# Altium schematic sheet rear_controller.SchDoc
size A; SheetNumber: 1; SheetTotal: 1
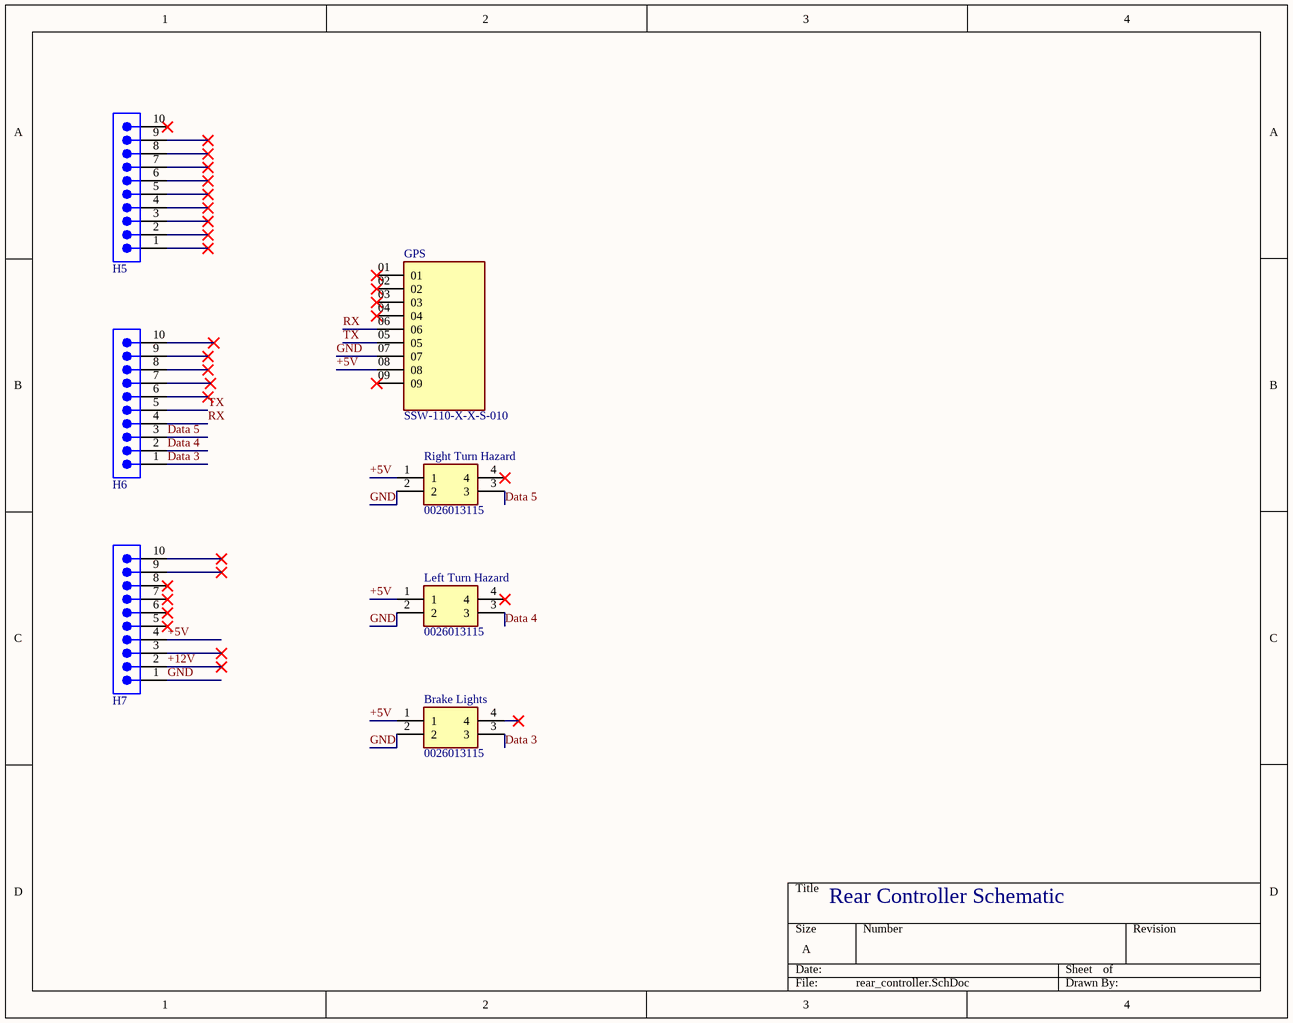
[diagram p0: rear_controller.SchDoc]

## Parts
Brake_Lights  0026013115  [MOLEX_0026013115]
GPS  SSW-110-X-X-S-010  [SAMTEC_SSW-110-X-X-S-010]
H5  61301011121  [61301011121]  (value not drawn)
H6  61301011121  [61301011121]  (value not drawn)
H7  61301011121  [61301011121]  (value not drawn)
Left_Turn_Hazard  0026013115  [MOLEX_0026013115]
Right_Turn_Hazard  0026013115  [MOLEX_0026013115]

## Nets
+5V: Brake_Lights.1 GPS.08 H7.4 Left_Turn_Hazard.1 Right_Turn_Hazard.1
+12V: H7.2
Data 3: Brake_Lights.3 H6.1
Data 4: H6.2 Left_Turn_Hazard.3
Data 5: H6.3 Right_Turn_Hazard.3
GND: Brake_Lights.2 GPS.07 H7.1 Left_Turn_Hazard.2 Right_Turn_Hazard.2
RX: GPS.06 H6.4
TX: GPS.05 H6.5

Not connected (* = marked no-connect by the designer): Brake_Lights 4*; GPS 01* 02* 03* 04* 09*; H5 1* 2* 3* 4* 5* 6* 7* 8* 9* 10*; H6 6* 7* 8* 9* 10*; H7 3* 5* 6* 7* 8* 9* 10*; Left_Turn_Hazard 4*; Right_Turn_Hazard 4*

## Notes on the sheet
- Rear Controller Schematic

## Library data of the parts
Brake_Lights Left_Turn_Hazard Right_Turn_Hazard = 0026013115: Connector Header Through Hole, Right Angle 4 position 0.165 (4.20mm); MF: Molex; Package: None; MP: 0026013115; DigiKey-Purchase-URL: https://snapeda.com/shop?store=DigiKey&id=2597941; Value: *; SnapEDA_Link: https://www.snapeda.com/parts/0026013115/Molex/view-part/2597941/?ref=snap; Price: None; Availability: Unavailable
GPS = SSW-110-X-X-S-010: 10 Position Receptacle Connector 0.100 (2.54mm) Through Hole Tin; MF: Samtec; MP: SSW-110-01-T-S-010; SnapEDA_Link: https://www.snapeda.com/parts/SSW-110-01-T-S-010/Samtec/view-part/?ref=snap; Package: None; Value: *; Check_prices: https://www.snapeda.com/parts/SSW-110-01-T-S-010/Samtec/view-part/?ref=eda
H5-H7 = 61301011121: WR-PHD Pin Header, THT, Vertical, pitch 2.54mm, 1 Row, 10P; Manufacturer: Wurth Elektronik; Contact Resistance: 20mOhm; Rated Current: 3A; Working Voltage: 250V; Withstanding Voltage: 500V; Manufacturer Part Number: 61301011121; Category: Board-to-Board Connectors; Match Code: WR-PHD; ComponentLink1Description: Website Link; ComponentLink1URL: https://www.we-online.com/redexpert/article/61301011121?ad; ComponentLink2Description: Datasheet Link; ComponentLink2URL: https://www.we-online.com/redexpert/spec/61301011121?ad; Mount: Through Hole; Operating Temperature Max: 105°C; Operating Temperature Min: -40°C; Packaging: Bag; Gender: Pin Header; Number of Pins: 10; Number of Rows: 1; Orientation: Vertical; Pitch: 2.54mm